# Altium schematic sheet Deneigus_MECHANICAL.SchDoc
size Tabloid; Sheet_Name: Mechanical; Size: 11x17
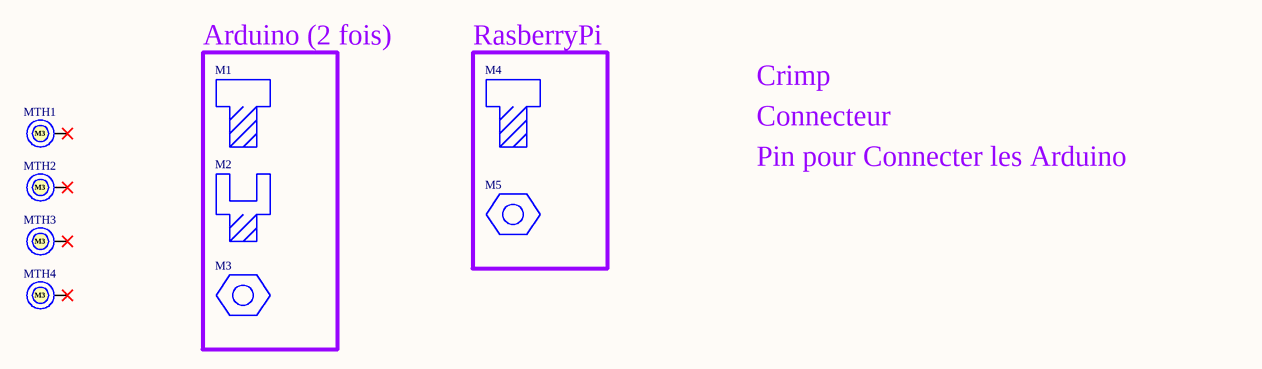
[diagram p0: Deneigus_MECHANICAL.SchDoc]

## Parts
M1  MACH SCREW PAN SLOTTED M3X0.5  (value not drawn)  (mechanical)
M2  HEX STANDOFF M3 NYLON 12MM  (value not drawn)  (mechanical)
M3  PLASTIC HEXAGON NUT M3  (value not drawn)  (mechanical)
M4  MACH SCREW PAN SLOTTED M2.5X0.45  (value not drawn)  (mechanical)
M5  PLASTIC HEXAGON NUT M2.5  (value not drawn)  (mechanical)
MTH1  M3  [MTH_M3]  (no BOM)
MTH2  M3  [MTH_M3]  (no BOM)
MTH3  M3  [MTH_M3]  (no BOM)
MTH4  M3  [MTH_M3]  (no BOM)

## Blocks framed on the sheet
Arduino (2 fois): M1-M3
RasberryPi: M4 M5

## Nets

Not connected (* = marked no-connect by the designer): MTH1 1*; MTH2 1*; MTH3 1*; MTH4 1*

## Notes on the sheet
- Crimp
- Connecteur
- Pin pour Connecter les Arduino
- Sheet Name
- Project Title
- Global Project
- Size
- Group
- Revision
- Date
- Sheet
- of
- Filename
- Designers

## Library data of the parts
M1 M4 = StandOff Screw: Supplier 1: Digi-Key
  M1: Supplier Part Number 1: 36-29341-ND; Quantity: 8
  M4: Quantity: 4; Supplier Part Number 1: 36-29334-ND
M2 = StandOff 12mm: Supplier 1: Digi-Key; Supplier Part Number 1: 36-25502-ND; Quantity: 8
M3 M5 = StandOff Nut: Supplier 1: Digi-Key
  M3: Supplier Part Number 1: 732-12637-ND; Quantity: 8
  M5: Quantity: 10; Supplier Part Number 1: 36-4687-ND
MTH1-MTH4 = MTH_M3: MTH - MOUNTING HOLE M3 PLATED - M3; GRAMS Lib Spec: 2.8; Magnetic Material: NO; Cryo: UNKNOWN; Value: *; Tolerance: *; Voltage Rating: *; Current Rating: *; Power Max: *; HelpURL: https://littlemachineshop.com/images/gallery/PDF/TapDrillSizes.pdf; CreatedBy/Date: Jonathan Bouchard 2018-07-23; VerifiedBy: Arnaud Samson 23-07-18; Temperature: *; Package: M3; Manufacturer #1: *; Manufacturer #2: *; Note: *; Assembly Type: NONE; Part Number #2: *; Part Number #1: *; Polarized: *; Supplier 1: *; Supplier Part Number 1: *